# Altium schematic sheet Sounder_Buzzer.SchDoc
size 87 x 67 mm
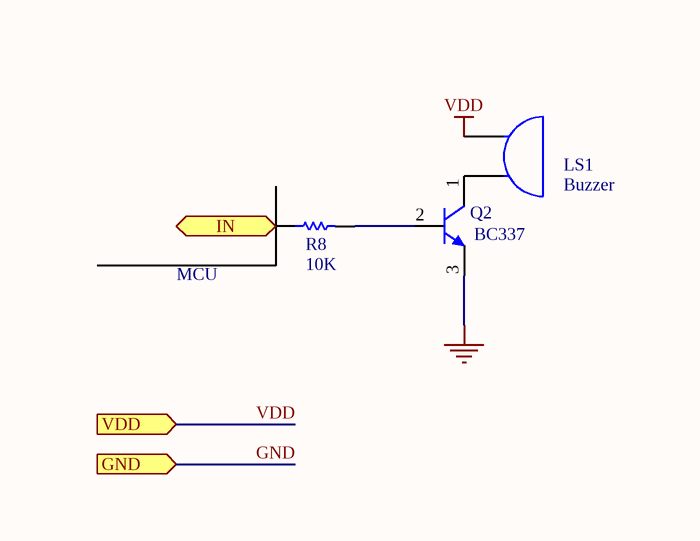
[diagram p0: Sounder_Buzzer.SchDoc]

## Parts
LS1  Buzzer  [BUZZER]
Q2  value BC337  [TO92C]  (hidden comment: NPN)
R8  value 10K  [AXIAL-0.4]  (hidden comment: Res1)

## Ports
GND, IN (in), VDD

## Nets
GND: Q2.3(E) ; port GND
VDD: LS1.1(A) ; port VDD
IN: R8.1 ; port IN
NetLS1_2: LS1.2(B) Q2.1(C)
NetQ2_2: Q2.2(B) R8.2

## Notes on the sheet
- MCU

## Library data of the parts
LS1 = Buzzer: Manufacturer: Generic Components; Published: 24-Mar-1999; Revision: July-2002: Re-released for DXP Platform.; Publisher: Altium Limited
Q2 = NPN: NPN Bipolar Transistor; Manufacturer: Generic Components; Class I: Discrete; Class II: BJT - Low Power; Published: 8-Jun-2000; Revision: July-2002: Re-released for DXP Platform.; Publisher: Altium Limited
R8 = Res1: Resistor; Manufacturer: Generic Components; Class I: Passive; Published: 8-Jun-2000; Revision: July-2002: Re-released for DXP Platform.; Publisher: Altium Limited; Class II: Resistor